# Altium project STM32 Blue Pill.PrjPcb
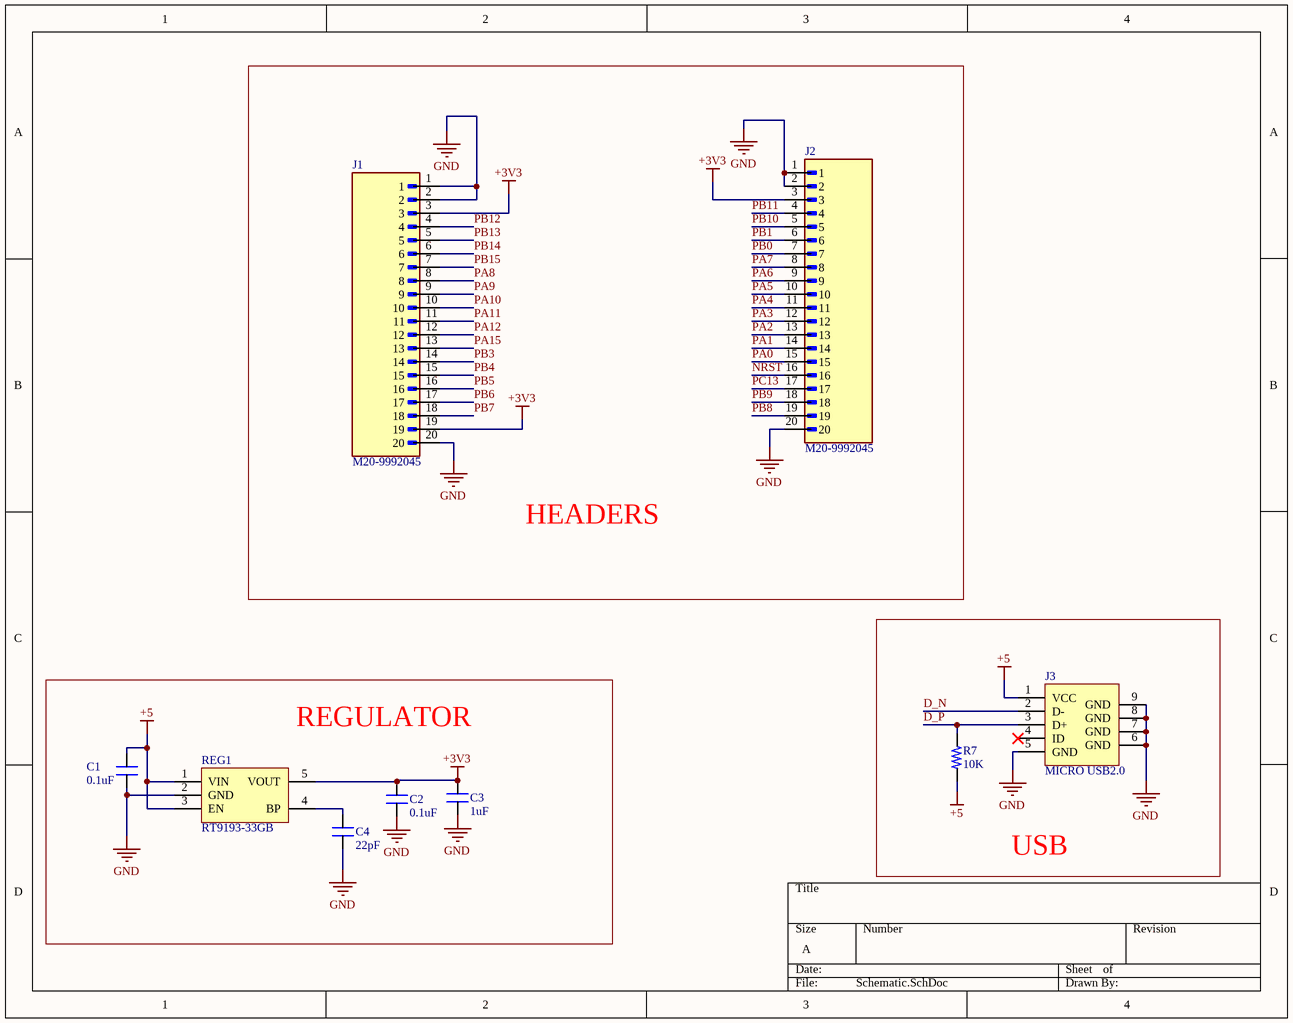
[diagram p0: Schematic.SchDoc]
2 sheets, 30 parts. Net scope: global (net labels, ports and power ports of the same name join across sheets).
Board file: PCB Design.PcbDoc
Sheets:
  Schematic.SchDoc
  Schematic2.SchDoc

## Sheet Schematic.SchDoc
size A; SheetNumber: 1; SheetTotal: 2

### Parts
C1  0.1uF  [CAP_0805]
C2  0.1uF  [CAP_0805]
C3  1uF  [CAP_0805]
C4  22pF  [CAP_0805]
J1  M20-9992045  [HARWIN_M20-9992045]
J2  M20-9992045  [HARWIN_M20-9992045]
J3  MICRO USB2.0  [CON_10118192-0001LF_SMD]
R7  10K  [RES_0805]
REG1  RT9193-33GB  [SOT23-5]

### Blocks framed on the sheet
HEADERS: J1 J2
USB: J3 R7
REGULATOR: C1-C4 REG1

### Nets
+3V3: C2.2 C3.2 J1.3 J1.19 J2.3 REG1.5(VOUT)
+5: C1.2 J3.1(VCC) R7.1 REG1.1(VIN) REG1.3(EN)
GND: C1.1 C2.1 C3.1 C4.1 J1.1 J1.2 J1.20 J2.1 J2.2 J2.20 J3.5(GND) J3.6(GND) J3.7(GND) J3.8(GND) J3.9(GND) REG1.2(GND)
D_N: J3.2(D-)
D_P: J3.3(D+) R7.2
NRST: J2.16
PA0: J2.15
PA1: J2.14
PA2: J2.13
PA3: J2.12
PA4: J2.11
PA5: J2.10
PA6: J2.9
PA7: J2.8
PA8: J1.8
PA9: J1.9
PA10: J1.10
PA11: J1.11
PA12: J1.12
PA15: J1.13
PB0: J2.7
PB1: J2.6
PB3: J1.14
PB4: J1.15
PB5: J1.16
PB6: J1.17
PB7: J1.18
PB8: J2.19
PB9: J2.18
PB10: J2.5
PB11: J2.4
PB12: J1.4
PB13: J1.5
PB14: J1.6
PB15: J1.7
PC13: J2.17
NetC4_2: C4.2 REG1.4(BP)

Not connected (* = marked no-connect by the designer): J3 4(ID)*

### Library data of the parts
C1 C2 = CAP_0.1uF-50V-5%-0805: 0.1µF ±5% 50V Ceramic Capacitor X7R 0805 (2012 Metric); Manufacturer: KEMET; Manufacturing Part Number: C0805C104J5RACTU; Case/Package: 0805 (2012 Metric); Supplier-1: Digikey; Supplier Part Number-1: 399-1171-1-ND
C3 = CAP_1uF-50V-5%-0805: 1µF ±5% 50V Ceramic Capacitor X7R 0805 (2012 Metric); Manufacturer: Yageo; Manufacturing Part Number: CC0805JKX7R9BB105; Case/Package: 0805 (2012 Metric); Supplier-1: Digikey; Supplier Part Number-1: 311-3498-1-ND
C4 = CAP_22pF-50V-5%-0805: 22pF ±5% 50V Ceramic Capacitor C0G, NP0 0805 (2012 Metric); Manufacturer: KEMET; Manufacturer Part Number: C0805C220J5GACTU; Case/Package: 0805; Supplier-1: Digikey; Supplier Part Number-1: 399-1113-1-ND
J1 J2 = M20-9992045: 2.54mm (0.1") Pitch SIL Vertical Throughboard Pin Header, 6.1mm mating pin height, gold (hi-temp mould), 20 contacts; MF: Harwin; Package: None; Price: None; Value: *; SnapEDA_Link: https://www.snapeda.com/parts/M20-9992045/Harwin/view-part/?ref=snap; MP: M20-9992045; Availability: Unavailable; Check_prices: https://www.snapeda.com/parts/M20-9992045/Harwin/view-part/?ref=eda
J3 = CON-USB_10118192-0002LF-SMD: USB - micro B USB 2.0 Receptacle Connector 5 Position Surface Mount, Right Angle; Manufacturer: Amphenol ICC (FCI); Manufacturing Part Number: 10118192-0002LF; Case/Package: SMD; Supplier-1: Digikey; Supplier Part Number-1: 609-5379-1-ND
R7 = RES_10K-0.125W-1%-0805: 10 kOhms ±1% 0.125W, 1/8W Chip Resistor 0805 (2012 Metric) Moisture Resistant Thick Film; Manufacturer: Yageo; Manufacturing Part Number: RC0805FR-0710KL; Case/Package: 0805; Supplier-1: Digikey; Supplier Part Number-1: 311-10.0KCRCT-ND
REG1 = REG_3.3V-5.5V-0.3A-SOT-23-5: Linear Voltage Regulator IC 1 Output 300mA SOT-23-5; Manufacturer: Richtek USA Inc.; Manufacturer Part Number: RT9193-33GB; Case/ Package: SOT-23-5; Supplier-1: Digikey; Supplier Part Number-1: 1028-1014-1-ND

## Sheet Schematic2.SchDoc
size A; SheetNumber: 2; SheetTotal: 2
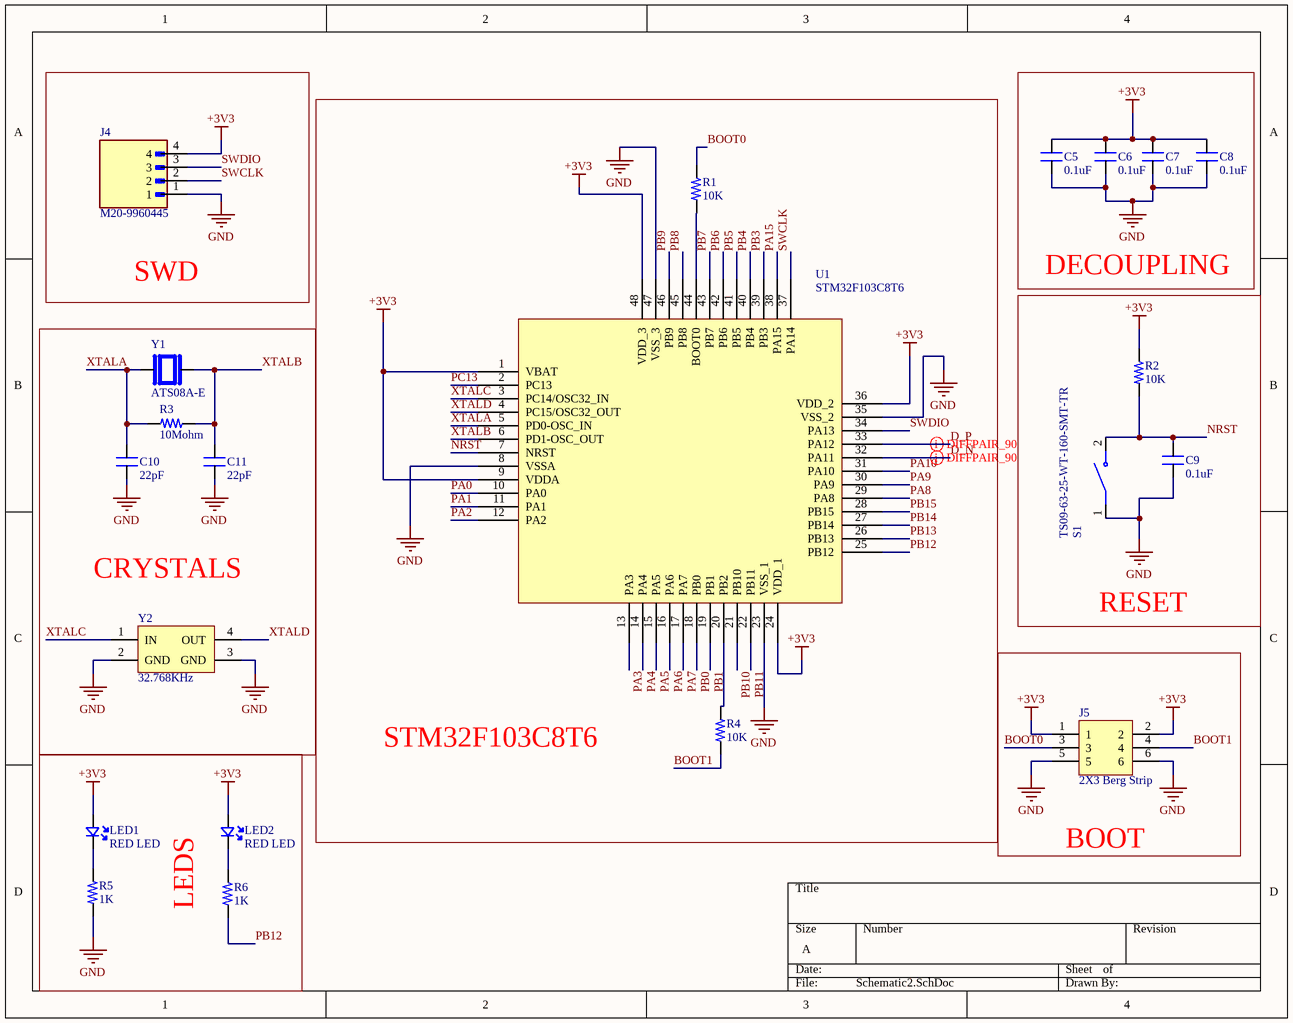
[diagram p1: Schematic2.SchDoc]

### Parts
C5  0.1uF  [CAP_0805]
C6  0.1uF  [CAP_0805]
C7  0.1uF  [CAP_0805]
C8  0.1uF  [CAP_0805]
C9  0.1uF  [CAP_0805]
C10  22pF  [CAP_0805]
C11  22pF  [CAP_0805]
J4  M20-9960445  [HARWIN_M20-9960445]
J5  2X3 Berg Strip  [CON6_100_59D78_TH_ST_Duplicate]
LED1  RED LED  [LED_0805]
LED2  RED LED  [LED_0805]
R1  10K  [RES_0805]
R2  10K  [RES_0805]
R3  10Mohm  [RES_0805]
R4  10K  [RES_0805]
R5  1K  [RES_0805]
R6  1K  [RES_0805]
S1  TS09-63-25-WT-160-SMT-TR  [SW_TS09-63-25-WT-160-SMT-TR]
U1  STM32F103C8T6  [LQFP-48_19.6_393_58X11_SMD]
Y1  ATS08A-E  [XTAL_HC49P488W43L1085T450H368]
Y2  32.768KHz  [XTAL_MC-405 32.7680K-G3]

### Blocks framed on the sheet
SWD: J4
DECOUPLING: C5-C8
STM32F103C8T6: R1 R4 U1
CRYSTALS: C10 C11 R3 Y1 Y2
RESET: C9 R2 S1
BOOT: J5
LEDS: LED1 LED2 R5 R6

### Nets
+3V3: C5.2 C6.2 C7.2 C8.2 J4.4 J5.1 J5.2 LED1.A LED2.A R2.2 U1.1(VBAT) U1.9(VDDA) U1.24(VDD_1) U1.36(VDD_2) U1.48(VDD_3)
GND: C5.1 C6.1 C7.1 C8.1 C9.1 C10.1 C11.1 J4.1 J5.5 J5.6 R5.1 S1.1 U1.8(VSSA) U1.23(VSS_1) U1.35(VSS_2) U1.47(VSS_3) Y2.2(GND) Y2.3(GND)
BOOT0: J5.3 R1.2
BOOT1: J5.4 R4.1
D_N: U1.32(PA11)
D_P: U1.33(PA12)
NRST: C9.2 R2.1 S1.2 U1.7(NRST)
PA0: U1.10(PA0)
PA1: U1.11(PA1)
PA2: U1.12(PA2)
PA3: U1.13(PA3)
PA4: U1.14(PA4)
PA5: U1.15(PA5)
PA6: U1.16(PA6)
PA7: U1.17(PA7)
PA8: U1.29(PA8)
PA9: U1.30(PA9)
PA10: U1.31(PA10)
PA15: U1.38(PA15)
PB0: U1.18(PB0)
PB1: U1.19(PB1)
PB3: U1.39(PB3)
PB4: U1.40(PB4)
PB5: U1.41(PB5)
PB6: U1.42(PB6)
PB7: U1.43(PB7)
PB8: U1.45(PB8)
PB9: U1.46(PB9)
PB10: U1.21(PB10)
PB11: U1.22(PB11)
PB12: R6.1 U1.25(PB12)
PB13: U1.26(PB13)
PB14: U1.27(PB14)
PB15: U1.28(PB15)
PC13: U1.2(PC13)
SWCLK: J4.2 U1.37(PA14)
SWDIO: J4.3 U1.34(PA13)
XTALA: C10.2 R3.1 U1.5(PD0-OSC_IN) Y1.1
XTALB: C11.2 R3.2 U1.6(PD1-OSC_OUT) Y1.2
XTALC: U1.3(PC14/OSC32_IN) Y2.1(IN)
XTALD: U1.4(PC15/OSC32_OUT) Y2.4(OUT)
NetLED1_K: LED1.K R5.2
NetLED2_K: LED2.K R6.2
NetR1_1: R1.1 U1.44(BOOT0)
NetR4_2: R4.2 U1.20(PB2)

### Layout directives
differential pair; differential pair class diff_90: D_N, D_P

### Library data of the parts
C5-C9 = CAP_0.1uF-50V-5%-0805: as C1 on sheet Schematic; Case/Package: 0805 (2012 Metric); Supplier-1: Digikey; Supplier Part Number-1: 399-1171-1-ND
C10 C11 = CAP_22pF-50V-5%-0805: as C4 on sheet Schematic; Case/Package: 0805; Supplier-1: Digikey; Supplier Part Number-1: 399-1113-1-ND
J4 = M20-9960445: 2.54mm (0.1) Pitch SIL Horizontal Throughboard Pin Header, 6.1mm mating pin height, gold (hi-temp mould), 4 contacts; MF: Harwin; SnapEDA_Link: https://www.snapeda.com/parts/M20-9960445/Harwin+Inc./view-part/?ref=snap; Package: None; Value: *; MP: M20-9960445; Check_prices: https://www.snapeda.com/parts/M20-9960445/Harwin+Inc./view-part/?ref=eda
J5 = CON-BS-PLG_2X3-100-TH-ST: 6 pin, 2 row, 2.54mm pitch bergstrip; Manufacturer: NA; Manufacturer Part Number: NA; Case/Package: TH; Supplier-1: NA; Supplier Part Number-1: NA
LED1 LED2 = LED-RED_10mA-0805: Red 621nm LED Indication - Discrete 2V 0805 (2012 Metric); Manufacturer: Lite-On Inc.; Manufacturer Part Number: LTST-C170EKT; Case/ Package: 0805; Supplier-1: Digikey; Supplier Part Number-1: 160-1178-1-ND
R1 R2 R4 = RES_10K-0.125W-1%-0805: as R7 on sheet Schematic; Case/Package: 0805; Supplier-1: Digikey; Supplier Part Number-1: 311-10.0KCRCT-ND
R3 = RES_10MOHM-0.125W-1%-0805: 10 MOhms ±1% 0.125W, 1/8W Chip Resistor 0805 (2012 Metric) Automotive AEC-Q200, High Voltage Thick Film; Manufacturer: Rohm Semiconductor; Manufacturing Part Number: KTR10EZPF1005; Case/Package: 0805 (2012 Metric); Supplier-1: Digikey; Supplier Part Number-1: RHM10.0MAHCT-ND
R5 R6 = RES_1K-0.125W-1%-0805: 1 kOhms ±1% 0.125W, 1/8W Chip Resistor 0805 (2012 Metric) Moisture Resistant Thick Film; Manufacturer: 垈㎵á; Manufacturer Part Number: RC0805FR-071KL; Case/Package: 0805; Supplier-1: Digikey; Supplier Part Number-1: 311-1.00KCRCT-ND
S1 = TS09-63-25-WT-160-SMT-TR: 6.1 x 3.7 mm, 2.5 mm Actuator Height, 160 gf, White, Surface Mount, SPST, Tactile Switch; MF: Same Sky; SnapEDA_Link: https://www.snapeda.com/parts/TS09-63-25-WT-160-SMT-TR/Same+Sky/view-part/?ref=snap; Package: None; Value: *; MP: TS09-63-25-WT-160-SMT-TR; Check_prices: https://www.snapeda.com/parts/TS09-63-25-WT-160-SMT-TR/Same+Sky/view-part/?ref=eda
U1 = IC-STM32F103C8T6 _1: ARM® Cortex®-M3 STM32F1 Microcontroller IC 32-Bit 72MHz 64KB (64K x 8) FLASH; Manufacturer: STMicroelectronics; Manufacturer Part Number: STM32F103C8T6; Case/Package: 48-LQFP; Supplier-1: Digikey; Supplier Part Number-1: 497-6063-ND
Y1 = ATS08A-E: 8 MHz Â±30ppm Crystal 20pF 60 Ohms HC-49/US; MF: CTS; SnapEDA_Link: https://www.snapeda.com/parts/ATS08A-E/CTS+Components/view-part/?ref=snap; Package: HC-49/US CTS-Frequency Controls; Value: *; MP: ATS08A-E; Check_prices: https://www.snapeda.com/parts/ATS08A-E/CTS+Components/view-part/?ref=eda
Y2 = XTAL_32.768KHz-MC-405 32.7680K-G3: Crystals SMD AT XTL MHZ +/-50PPM 12.5 PF 250 T/R; Manufacturer: Epson; Manufacturing Part Number: MC-405 32.7680K-G3: ROHS; Case/Package: SMD; Supplier-1: Mouser; Supplier Part Number-1: 732-MC405327680KG3RS

## Nets that join several sheets
+3V3: Schematic (6 pins), Schematic2 (15 pins)
GND: Schematic (16 pins), Schematic2 (18 pins)
D_N: Schematic (J3.2), Schematic2 (U1.32)
D_P: Schematic (J3.3 R7.2), Schematic2 (U1.33)
NRST: Schematic (J2.16), Schematic2 (C9.2 R2.1 S1.2 U1.7)
PA0: Schematic (J2.15), Schematic2 (U1.10)
PA1: Schematic (J2.14), Schematic2 (U1.11)
PA2: Schematic (J2.13), Schematic2 (U1.12)
PA3: Schematic (J2.12), Schematic2 (U1.13)
PA4: Schematic (J2.11), Schematic2 (U1.14)
PA5: Schematic (J2.10), Schematic2 (U1.15)
PA6: Schematic (J2.9), Schematic2 (U1.16)
PA7: Schematic (J2.8), Schematic2 (U1.17)
PA8: Schematic (J1.8), Schematic2 (U1.29)
PA9: Schematic (J1.9), Schematic2 (U1.30)
PA10: Schematic (J1.10), Schematic2 (U1.31)
PA15: Schematic (J1.13), Schematic2 (U1.38)
PB0: Schematic (J2.7), Schematic2 (U1.18)
PB1: Schematic (J2.6), Schematic2 (U1.19)
PB3: Schematic (J1.14), Schematic2 (U1.39)
PB4: Schematic (J1.15), Schematic2 (U1.40)
PB5: Schematic (J1.16), Schematic2 (U1.41)
PB6: Schematic (J1.17), Schematic2 (U1.42)
PB7: Schematic (J1.18), Schematic2 (U1.43)
PB8: Schematic (J2.19), Schematic2 (U1.45)
PB9: Schematic (J2.18), Schematic2 (U1.46)
PB10: Schematic (J2.5), Schematic2 (U1.21)
PB11: Schematic (J2.4), Schematic2 (U1.22)
PB12: Schematic (J1.4), Schematic2 (R6.1 U1.25)
PB13: Schematic (J1.5), Schematic2 (U1.26)
PB14: Schematic (J1.6), Schematic2 (U1.27)
PB15: Schematic (J1.7), Schematic2 (U1.28)
PC13: Schematic (J2.17), Schematic2 (U1.2)